# EAGLE schematic control (EAGLE 6.3)
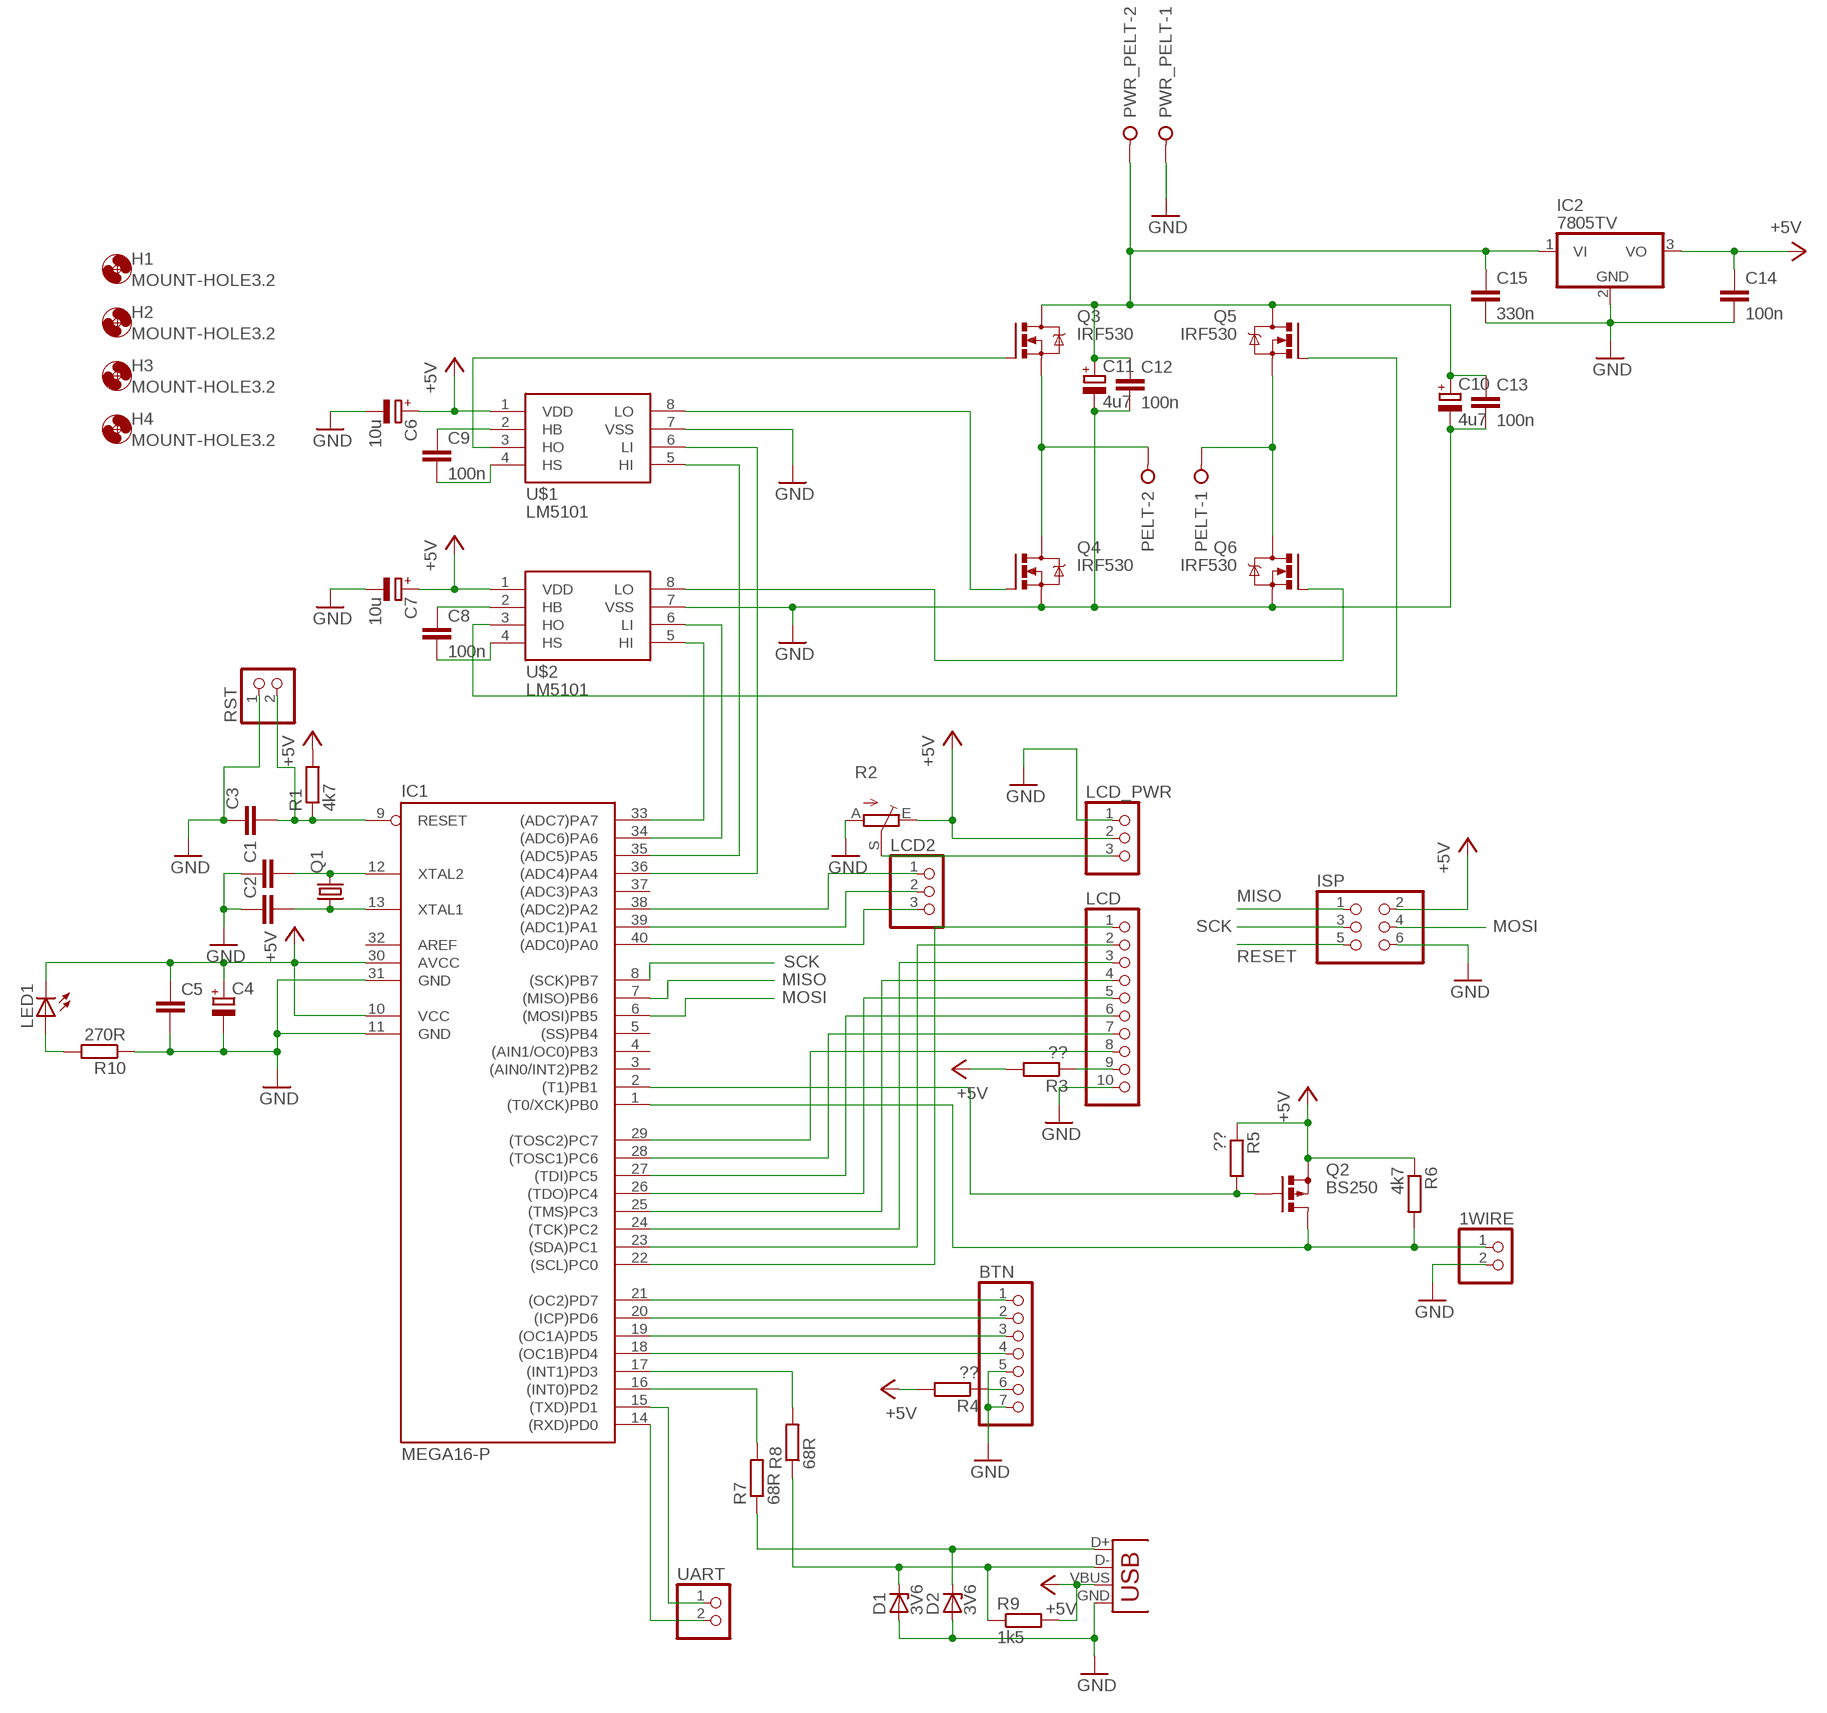
[diagram p0: schematic, sheet 1]

## Parts
1WIRE  PINHD-1X2  [1X02]
BTN  PINHD-1X7  [1X07]
C1  C-EU025-025X050  [C025-025X050]
C2  C-EU025-025X050  [C025-025X050]
C3  C-EU050-024X044  [C050-024X044]
C4  CPOL-EUE2.5-5  [E2,5-5]
C5  C-EU050-024X044  [C050-024X044]
C6  10u  CPOL-EUE2.5-5  [E2,5-5]
C7  10u  CPOL-EUE2.5-5  [E2,5-5]
C8  100n  C-EU025-025X050  [C025-025X050]
C9  100n  C-EU025-025X050  [C025-025X050]
C10  4u7  CPOL-EUE5-5  [E5-5]
C11  4u7  CPOL-EUE5-5  [E5-5]
C12  100n  C-EU025-025X050  [C025-025X050]
C13  100n  C-EU025-025X050  [C025-025X050]
C14  100n  C-EU025-025X050  [C025-025X050]
C15  330n  C-EU025-025X050  [C025-025X050]
D1  3V6  ZENER-DIODEZD-7.5  [ZDIO-7.5]
D2  3V6  ZENER-DIODEZD-7.5  [ZDIO-7.5]
H1  MOUNT-HOLE3.2  [3,2]
H2  MOUNT-HOLE3.2  [3,2]
H3  MOUNT-HOLE3.2  [3,2]
H4  MOUNT-HOLE3.2  [3,2]
IC1  MEGA16-P  [DIL40]
IC2  7805TV  [TO220V]
ISP  PINHD-2X3  [2X03]
LCD  PINHD-1X10  [1X10]
LCD2  PINHD-1X3  [1X03]
LCD_PWR  PINHD-1X3  [1X03]
LED1  LED3MM  [LED3MM]
PELT  W237-02P  [W237-132]
PWR_PELT  W237-02P  [W237-132]
Q1  CRYSTALHC49U-V  [HC49U-V]
Q2  BS250  [SOT54E]
Q3  IRF530  [TO220BV]
Q4  IRF530  [TO220BV]
Q5  IRF530  [TO220BV]
Q6  IRF530  [TO220BV]
R1  4k7  R-EU_0207/10  [0207/10]
R2  TRIM_EU-LI10  [LI10]
R3  ??  R-EU_0207/10  [0207/10]
R4  ??  R-EU_0207/10  [0207/10]
R5  ??  R-EU_0207/10  [0207/10]
R6  4k7  R-EU_0207/10  [0207/10]
R7  68R  R-EU_0207/10  [0207/10]
R8  68R  R-EU_0207/10  [0207/10]
R9  1k5  R-EU_0207/10  [0207/10]
R10  270R  R-EU_0207/10  [0207/10]
RST  PINHD-1X2  [1X02]
U$1  LM5101  [SOIC8]
U$2  LM5101  [SOIC8]
UART  PINHD-1X2  [1X02]
X1  USBPTH  [USB-B-PTH]

## Nets
+5V: C4.+ C5.1 C6.+ C7.+ C14.1 IC1.10(VCC) IC1.30(AVCC) IC2.3(VO) ISP.2 LCD_PWR.2 LED1.K(C) Q2.S R1.2 R2.E R3.2 R4.2 R5.1 R6.1 R9.2 U$1.1(VDD) U$2.1(VDD) X1.VBUS
GND: 1WIRE.2 BTN.5 BTN.7 C1.1 C2.1 C3.1 C4.- C5.2 C6.- C7.- C10.- C11.- C12.2 C13.2 C14.2 C15.2 D1.A D2.A IC1.11(GND) IC1.31(GND) IC2.2(GND) ISP.6 LCD.10 LCD_PWR.1 PWR_PELT.1 Q4.S Q6.S R2.A R10.1 RST.1 U$1.7(VSS) U$2.7(VSS) X1.GND
MISO: IC1.7((MISO)PB6) ISP.1
MOSI: IC1.6((MOSI)PB5) ISP.4
N$1: C1.2 IC1.12(XTAL2) Q1.2
N$2: C2.2 IC1.13(XTAL1) Q1.1
N$3: IC1.33((ADC7)PA7) U$2.5(HI)
N$4: IC1.2((T1)PB1) Q2.G R5.2
N$5: LCD.9 R3.1
N$6: LCD_PWR.3 R2.S
N$7: IC1.22((SCL)PC0) LCD.1
N$8: IC1.23((SDA)PC1) LCD.2
N$9: IC1.24((TCK)PC2) LCD.3
N$10: IC1.25((TMS)PC3) LCD.4
N$11: IC1.26((TDO)PC4) LCD.5
N$12: IC1.27((TDI)PC5) LCD.6
N$13: IC1.28((TOSC1)PC6) LCD.7
N$14: IC1.29((TOSC2)PC7) LCD.8
N$15: IC1.40((ADC0)PA0) LCD2.3
N$16: IC1.39((ADC1)PA1) LCD2.2
N$17: IC1.38((ADC2)PA2) LCD2.1
N$18: IC1.16((INT0)PD2) R7.2
N$19: IC1.17((INT1)PD3) R8.2
N$20: BTN.6 R4.1
N$21: BTN.1 IC1.21((OC2)PD7)
N$22: BTN.2 IC1.20((ICP)PD6)
N$23: BTN.3 IC1.19((OC1A)PD5)
N$24: BTN.4 IC1.18((OC1B)PD4)
N$25: 1WIRE.1 IC1.1((T0/XCK)PB0) Q2.D R6.2
N$26: IC1.15((TXD)PD1) UART.1
N$27: IC1.14((RXD)PD0) UART.2
N$28: D2.C R7.1 X1.D+
N$29: D1.C R8.1 R9.1 X1.D-
N$30: IC1.34((ADC6)PA6) U$2.6(LI)
N$31: IC1.35((ADC5)PA5) U$1.5(HI)
N$32: IC1.36((ADC4)PA4) U$1.6(LI)
N$33: C9.1 U$1.2(HB)
N$34: C8.1 U$2.2(HB)
N$35: C8.2 U$2.4(HS)
N$36: C9.2 U$1.4(HS)
N$37: PELT.2 Q3.S Q4.D
N$38: PELT.1 Q5.S Q6.D
N$39: Q3.G U$1.3(HO)
N$40: Q4.G U$1.8(LO)
N$41: Q5.G U$2.3(HO)
N$42: Q6.G U$2.8(LO)
N$43: LED1.A R10.2
N$46: C10.+ C11.+ C12.1 C13.1 C15.1 IC2.1(VI) PWR_PELT.2 Q3.D Q5.D
RESET: C3.2 IC1.9(RESET) ISP.5 R1.1 RST.2
SCK: IC1.8((SCK)PB7) ISP.3
Unconnected: IC1.3((AIN0/INT2)PB2) IC1.4((AIN1/OC0)PB3) IC1.5((SS)PB4) IC1.32(AREF) IC1.37((ADC3)PA3)

## Library data of the parts
1WIRE RST UART = pinhead:PINHD-1X2: PIN HEADER
BTN = pinhead:PINHD-1X7: PIN HEADER
C1-C3 C5 C8 C9 C12-C15 = resistor:C-EU: CAPACITOR, European symbol
C4 C6 C7 C10 C11 = resistor:CPOL-EU: POLARIZED CAPACITOR, European symbol
D1 D2 = diode:ZENER-DIODE: Z-Diode
H1-H4 = holes:MOUNT-HOLE: MOUNTING HOLE with drill center marker
IC1 = atmel:MEGA16-P: MICROCONTROLLER 16 Kbytes FLASH 1 kbytes SRAM 512 bytes EEPROM USART 8-channel 10 bit ADC Source: avr.lbr; MPN: ATMEGA16-16PU; OC_FARNELL: 9171142; OC_NEWARK: 01M6885
IC2 = linear:78*: Positive VOLTAGE REGULATOR Source: http://cache.national.com/ds/LM/LM78L05.pdf http://www.fairchildsemi.com/ds/LM/LM7805.pdf
ISP = pinhead:PINHD-2X3: PIN HEADER
LCD = pinhead:PINHD-1X10: PIN HEADER
LCD2 LCD_PWR = pinhead:PINHD-1X3: PIN HEADER
LED1 = led:LED: LED OSRAM: - CHIPLED LG R971, LG N971, LY N971, LG Q971, LY Q971, LO R971, LY R971 LH N974, LH R974 LS Q976, LO Q976, LY Q976 LO Q996 - Hyper CHIPLED LW Q18S LB Q993, LB Q99A, LB R99A - SideLED LS A670, LO A670, LY A670, LG A670, LP A670 LB A673, LV A673, LT A673, LW A673 LH A674 LY A675 LS A676, LA A676, LO A676, LY A676, LW A676 LS A679, LY A679, LG A679 - Hyper Micro SIDELED® LS Y876, LA Y876, LO Y876, LY Y876 LT Y87S - SmartLED LW L88C, LW L88S LB L89C, LB L89S, LG L890 LS L89K, LO L89K, LY L89K LS L896, LA L896, LO L896, LY L896 - TOPLED LS T670, LO T670, LY T670, LG T670, LP T670 LSG T670, LSP T670, LSY T670, LOP T670, LYG T670 LG T671, LOG T671, LSG T671 LB T673, LV T673, LT T673, LW T673 LH T674 LS T676, LA T676, LO T676, LY T676, LB T676, LH T676, LSB T676, LW T676 LB T67C, LV T67C, LT T67C, LS T67K, LO T67K, LY T67K, LW E67C LS E67B, LA E67B, LO E67B, LY E67B, LB E67C, LV E67C, LT E67C LW T67C LS T679, LY T679, LG T679 LS T770, LO T770, LY T770, LG T770, LP T770 LB T773, LV T773, LT T773, LW T773 LH T774 LS E675, LA E675, LY E675, LS T675 LS T776, LA T776, LO T776, LY T776, LB T776 LHGB T686 LT T68C, LB T68C - Hyper Mini TOPLED® LB M676 - Mini TOPLED Santana® LG M470 LS M47K, LO M47K, LY M47K Source: http://www.osram.convergy.de LUXEON: - LUMILED® LXK2-PW12-R00, LXK2-PW12-S00, LXK2-PW14-U00, LXK2-PW14-V00 LXK2-PM12-R00, LXK2-PM12-S00, LXK2-PM14-U00 LXK2-PE12-Q00, LXK2-PE12-R00, LXK2-PE12-S00, LXK2-PE14-T00, LXK2-PE14-U00 LXK2-PB12-K00, LXK2-PB12-L00, LXK2-PB12-M00, LXK2-PB14-N00, LXK2-PB14-P00, LXK2-PB14-Q00 LXK2-PR12-L00, LXK2-PR12-M00, LXK2-PR14-Q00, LXK2-PR14-R00 LXK2-PD12-Q00, LXK2-PD12-R00, LXK2-PD12-S00 LXK2-PH12-R00, LXK2-PH12-S00 LXK2-PL12-P00, LXK2-PL12-Q00, LXK2-PL12-R00 Source: www.luxeon.com KINGBRIGHT: KA-3528ASYC Source: www.kingbright.com
PELT PWR_PELT = con-wago-508:W237-02P: WAGO SREW CLAMP; OC_FARNELL: unknown; OC_NEWARK: unknown
Q1 = crystal:CRYSTAL: CRYSTAL; OC_FARNELL: 1666969; OC_NEWARK: unknown
Q2 = transistor-small-signal:BS250: P-CHANNEL MOS FET
Q3-Q6 = transistor-power:IRF530: HEXFET Power MOSFET
R1 R3-R10 = resistor:R-EU_: RESISTOR, European symbol
R2 = pot:TRIM_EU-: POTENTIOMETER
U$1 U$2 = lm5101:LM5101
X1 = SparkFun:USB: USB Connectors USB-B-PTH is fully proven SKU : PRT-00139 USB-miniB is fully proven SKU : PRT-00587 USB-A-PCB is untested. USB-A-H is throughly reviewed, but untested. Spark Fun Electronics SKU : PRT-00437 USB-B-SMT is throughly reviewed, but untested. Needs silkscreen touching up. USB-A-S has not been used/tested USB-MB-H has not been used/tested